# Altium schematic sheet S7CAS-PLEIADES-CARTE-MERE_P02_ETHERNET.SchDoc
size Tabloid; DocumentNumber: 10; SheetNumber: 10; SheetTotal: 14; Size: 11x17; Sheet_Name: Ethernet
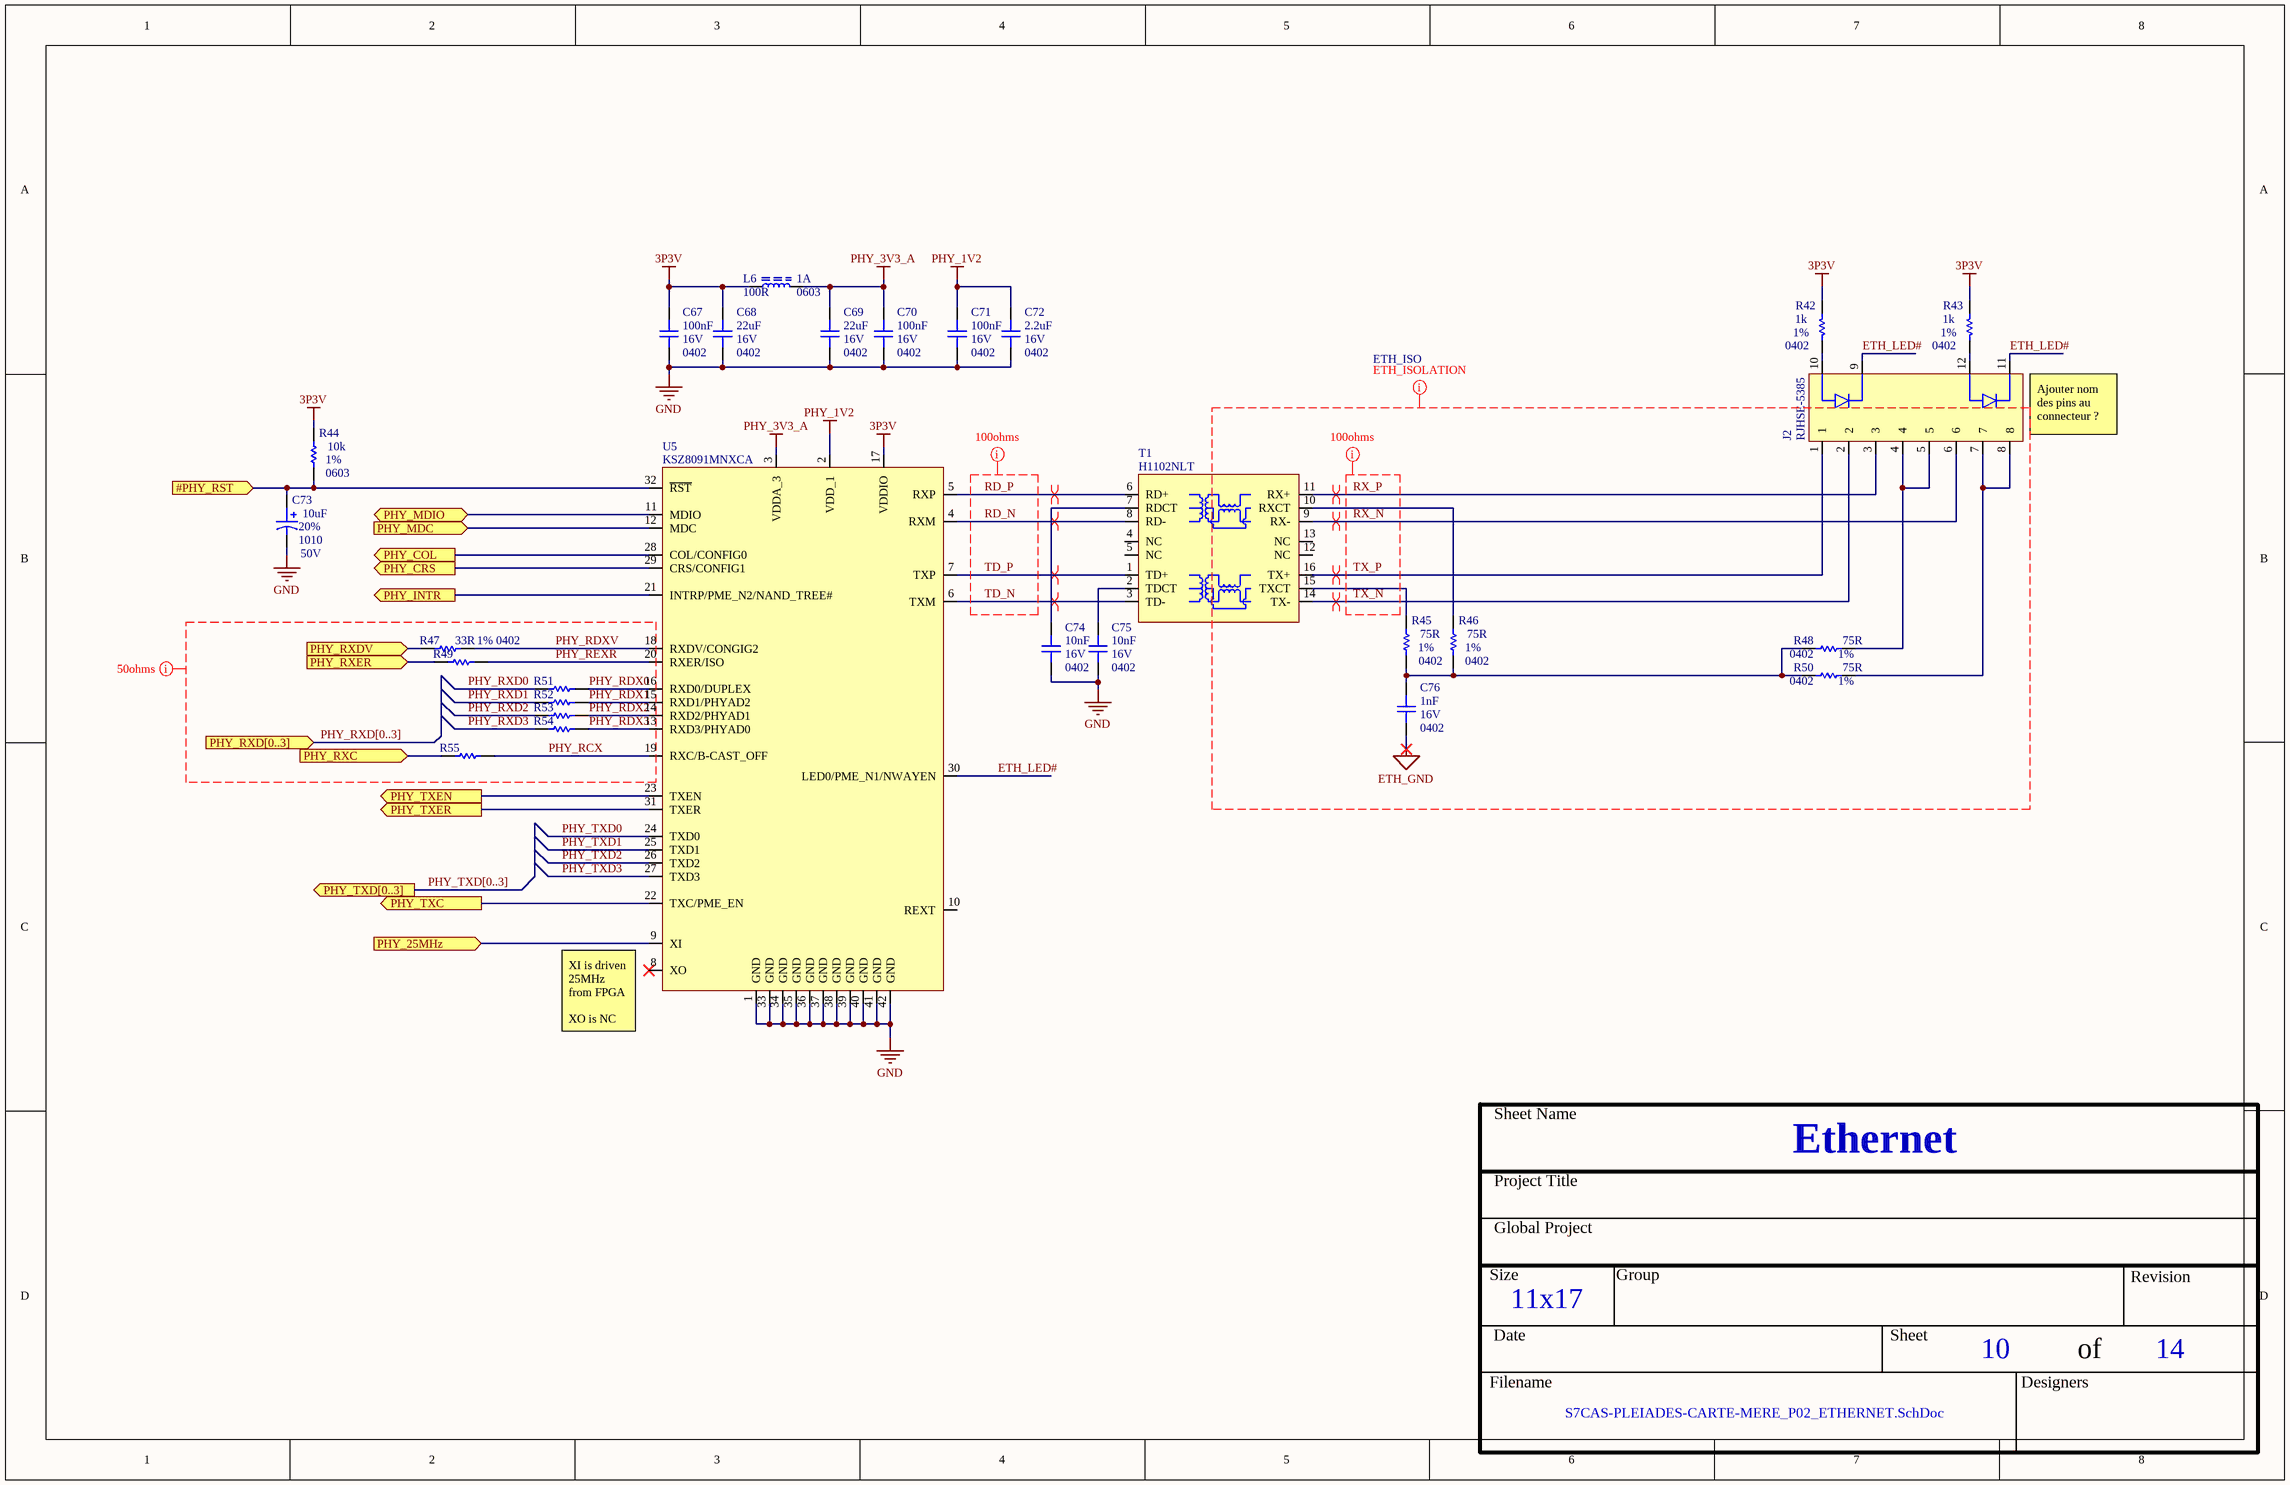
[diagram p0: S7CAS-PLEIADES-CARTE-MERE_P02_ETHERNET.SchDoc]

## Parts
C67  value 100nF  Voltage: 16V  Package: 0402  [CAP_0402]  (hidden comment: CAP - 0402)
C68  value 22uF  Voltage: 16V  Package: 0402  [CAP_0402]  (hidden comment: CAP - 0402)
C69  value 22uF  Voltage: 16V  Package: 0402  [CAP_0402]  (hidden comment: CAP - 0402)
C70  value 100nF  Voltage: 16V  Package: 0402  [CAP_0402]  (hidden comment: CAP - 0402)
C71  value 100nF  Voltage: 16V  Package: 0402  [CAP_0402]  (hidden comment: CAP - 0402)
C72  value 2.2uF  Voltage: 16V  Package: 0402  [CAP_0402]  (hidden comment: CAP - 0402)
C73  value 10uF  Voltage: 50V  Package: 1010  Precision: 20%  [CAP_ALU_1010_vishay]  (hidden comment: MAL215099101E3)
C74  value 10nF  Voltage: 16V  Package: 0402  [CAP_0402]  (hidden comment: CAP - 0402)
C75  value 10nF  Voltage: 16V  Package: 0402  [CAP_0402]  (hidden comment: CAP - 0402)
C76  value 1nF  Voltage: 16V  Package: 0402  [CAP_0402]  (hidden comment: CAP - 0402)
J2  RJHSE-5385  [CONN_ETHERNET_RJHSE-5385]
L6  value 100R  Current: 1A  Package: 0603  [FER_0603]  (hidden comment: FER - 0603)
R42  value 1k  Package: 0402  Precision: 1%  [RES_0402]  (hidden comment: RES - 0402)
R43  value 1k  Package: 0402  Precision: 1%  [RES_0402]  (hidden comment: RES - 0402)
R44  value 10k  Package: 0603  Precision: 1%  [RES_0603]  (hidden comment: RES - 0603)
R45  value 75R  Package: 0402  Precision: 1%  [RES_0402]  (hidden comment: RES - 0402)
R46  value 75R  Package: 0402  Precision: 1%  [RES_0402]  (hidden comment: RES - 0402)
R47  value 33R  Package: 0402  Precision: 1%  [RES_0402]  (hidden comment: RES - 0402)
R48  value 75R  Package: 0402  Precision: 1%  [RES_0402]  (hidden comment: RES - 0402)
R49  RES - 0402  [RES_0402]  (value not drawn)
R50  value 75R  Package: 0402  Precision: 1%  [RES_0402]  (hidden comment: RES - 0402)
R51  RES - 0402  [RES_0402]  (value not drawn)
R52  RES - 0402  [RES_0402]  (value not drawn)
R53  RES - 0402  [RES_0402]  (value not drawn)
R54  RES - 0402  [RES_0402]  (value not drawn)
R55  RES - 0402  [RES_0402]  (value not drawn)
T1  H1102NLT  [TRANSFO_H1102NLT]
U5  KSZ8091MNXCA  [COM_ETH_PHY_KSZ8091MNXCA]

## Ports
#PHY_RST (in), PHY_25MHz (in), PHY_COL (out), PHY_CRS (out), PHY_INTR (out), PHY_MDC (in), PHY_MDIO (bidir), PHY_RXC (in), PHY_RXD[0..3] (in), PHY_RXDV (in), PHY_RXER (in), PHY_TXC (out), PHY_TXD[0..3] (out), PHY_TXEN (out), PHY_TXER (out)

## Nets
3P3V: C67.2 C68.2 L6.2 R42.2 R43.2 R44.2 U5.17(VDDIO)
ETH_GND: C76.1
GND: C67.1 C68.1 C69.1 C70.1 C71.1 C72.1 C73.2 C74.1 C75.1 U5.1(GND) U5.33(GND) U5.34(GND) U5.35(GND) U5.36(GND) U5.37(GND) U5.38(GND) U5.39(GND) U5.40(GND) U5.41(GND) U5.42(GND)
PHY_1V2: C71.2 C72.2 U5.2(VDD_1)
PHY_3V3_A: C69.2 C70.2 L6.1 U5.3(VDDA_3)
#PHY_RST: C73.1 R44.1 U5.32(~{RST}) ; port #PHY_RST
ETH_LED#: J2.9(LED1_K) J2.11(LED2_K) U5.30(LED0/PME_N1/NWAYEN)
PHY_25MHz: U5.9(XI) ; port PHY_25MHz
PHY_COL: U5.28(COL/CONFIG0) ; port PHY_COL
PHY_CRS: U5.29(CRS/CONFIG1) ; port PHY_CRS
PHY_INTR: U5.21(INTRP/PME_N2/NAND_TREE#) ; port PHY_INTR
PHY_MDC: U5.12(MDC) ; port PHY_MDC
PHY_MDIO: U5.11(MDIO) ; port PHY_MDIO
PHY_RCX: R55.1 U5.19(RXC/B-CAST_OFF)
PHY_RDX0: R51.1 U5.16(RXD0/DUPLEX)
PHY_RDX1: R52.1 U5.15(RXD1/PHYAD2)
PHY_RDX2: R53.1 U5.14(RXD2/PHYAD1)
PHY_RDX3: R54.1 U5.13(RXD3/PHYAD0)
PHY_RDXV: R47.1 U5.18(RXDV/CONGIG2)
PHY_REXR: R49.1 U5.20(RXER/ISO)
PHY_RXC: R55.2 ; port PHY_RXC
PHY_RXD0: R51.2
PHY_RXD1: R52.2
PHY_RXD2: R53.2
PHY_RXD3: R54.2
PHY_RXDV: R47.2 ; port PHY_RXDV
PHY_RXER: R49.2 ; port PHY_RXER
PHY_TXC: U5.22(TXC/PME_EN) ; port PHY_TXC
PHY_TXD0: U5.24(TXD0)
PHY_TXD1: U5.25(TXD1)
PHY_TXD2: U5.26(TXD2)
PHY_TXD3: U5.27(TXD3)
PHY_TXEN: U5.23(TXEN) ; port PHY_TXEN
PHY_TXER: U5.31(TXER) ; port PHY_TXER
RD_N: T1.8(RD-) U5.4(RXM)
RD_P: T1.6(RD+) U5.5(RXP)
RX_N: J2.6 T1.9(RX-)
RX_P: J2.3 T1.11(RX+)
TD_N: T1.3(TD-) U5.6(TXM)
TD_P: T1.1(TD+) U5.7(TXP)
TX_N: J2.2 T1.14(TX-)
TX_P: J2.1 T1.16(TX+)
NetC74_2: C74.2 T1.7(RDCT)
NetC75_2: C75.2 T1.2(TDCT)
NetC76_2: C76.2 R45.1 R46.1 R48.1 R50.1
NetJ2_4: J2.4 J2.5 R48.2
NetJ2_7: J2.7 J2.8 R50.2
NetJ2_10: J2.10(LED1_A) R42.1
NetJ2_12: J2.12(LED2_A) R43.1
NetR45_2: R45.2 T1.15(TXCT)
NetR46_2: R46.2 T1.10(RXCT)

Not connected (* = marked no-connect by the designer): T1 4(NC) 5(NC) 12(NC) 13(NC); U5 8(XO)* 10(REXT)

## Buses and harness runs
bus PHY_RXD[0..3] = port PHY_RXD[0..3]
bus PHY_TXD[0..3] = port PHY_TXD[0..3]

## Layout directives
net class 50ohms: PHY_RCX, PHY_RDX0, PHY_RDX1, PHY_RDX2, PHY_RDX3, PHY_RDXV, PHY_REXR, PHY_RXD0, PHY_RXD1, PHY_RXD2, PHY_RXD3, PHY_RXD[0..3]
net class 100ohms: RD_N, RD_P, RX_N, RX_P, TD_N, TD_P, TX_N, TX_P
differential pair: RD_N, RX_N, RX_P, TD_N, TD_P, TX_N, TX_P
differential pair; differential pair class *; differential pair class *: RD_P
net class ETH_ISO: ETH_GND, RX_N, RX_P, TX_N, TX_P

## Notes on the sheet
- (near J2) Ajouter nom des pins au connecteur ?
- (near U5) XI is driven 25MHz from FPGA
  XO is NC
- Sheet Name
- Project Title
- Global Project
- Size
- Group
- Revision
- Date
- Sheet
- of
- Filename
- Designers

## Library data of the parts
C67-C72 C74-C76 = CAP - 0402: Precision: 10%; Current: *; CreatedBy: Jonathan Bouchard; Power: *
C73 = CAP_ALU_MAL215099101E3: CAP - ALU 100uF 20% 50V - 1010; Current: 490mA; Mfg: Vishay Dale; Mfg Part Number: MAL215099101E3; HelpURL: http://www.vishay.com/docs/28395/150crz.pdf; CreatedBy: Jonathan Bouchard; Temperature: -55°C to 125°C; Power: *; Supplier 1: Digikey; Supplier Part Number 1: 4399PHDKR-ND
J2 = CONN_ETHERNET_RJHSE-5385: CONN - MOD JACK RJ45 R/A ETHERNET - TH; Mfg: Amphenol; Voltage: *; Current: *; Power: *; Mfg Part Number: RJHSE-5385; HelpURL: https://www.amphenolcanada.com/ProductSearch/drawings/AC/RJHSE538X.pdf; CreatedBy: Jonathan Bouchard; Temperature: -55°C ~ 85°C; Value: *; Precision: *; Package: TH-12; Supplier 1: Digikey; Supplier Part Number 1: RJHSE-5385-ND
R42 R43 R45-R55 = RES - 0402: Voltage: 50V; Power: 1/16W; Current: *; CreatedBy: Jonathan Bouchard
T1 = TRANSFO_H1102NLT: TRANSFO - ETHERNET 10/100B-TX - SMD-16; Mfg: Pulse Eng.; Value: 1:1 (350uH); Voltage: *; Current: *; Power: *; Mfg Part Number: H1102NLT; HelpURL: http://media.digikey.com/pdf/Data%20Sheets/Pulse%20PDFs/10_100BASE-T%20Single%20Port%20SMD%20Magnetics_Rev2008.pdf; CreatedBy: Jonathan Bouchard; Temperature: -40°C to 85°C; Precision: *; Package: SMD-16; Supplier 1: Digikey; Supplier Part Number 1: 553-1532-1-ND
U5 = COM_ETH_PHY_KSZ8091MNXCA: COM - ETHERNET PHY 10/100 - QFN-32; Voltage: 1.8V, 2.5V, 3.3V; Mfg: Micrel; Current: *; Power: *; Mfg Part Number: KSZ8091MNXCA; HelpURL: http://ww1.microchip.com/downloads/en/DeviceDoc/00002275A.pdf; CreatedBy: Jonathan Bouchard; Temperature: 0°C ~ 70°C; Value: *; Precision: *; Package: QFN-32; Supplier 1: Digikey; Supplier Part Number 1: 576-4356-ND
L6 = FER - 0603: Voltage: *; CreatedBy: Jonathan Bouchard; Power: *; Precision: *
R44 = RES - 0603: Current: *; CreatedBy: Jonathan Bouchard